# Altium schematic sheet Controller.SchDoc
size 420 x 297 mm; SheetNumber: 4; SheetTotal: 4
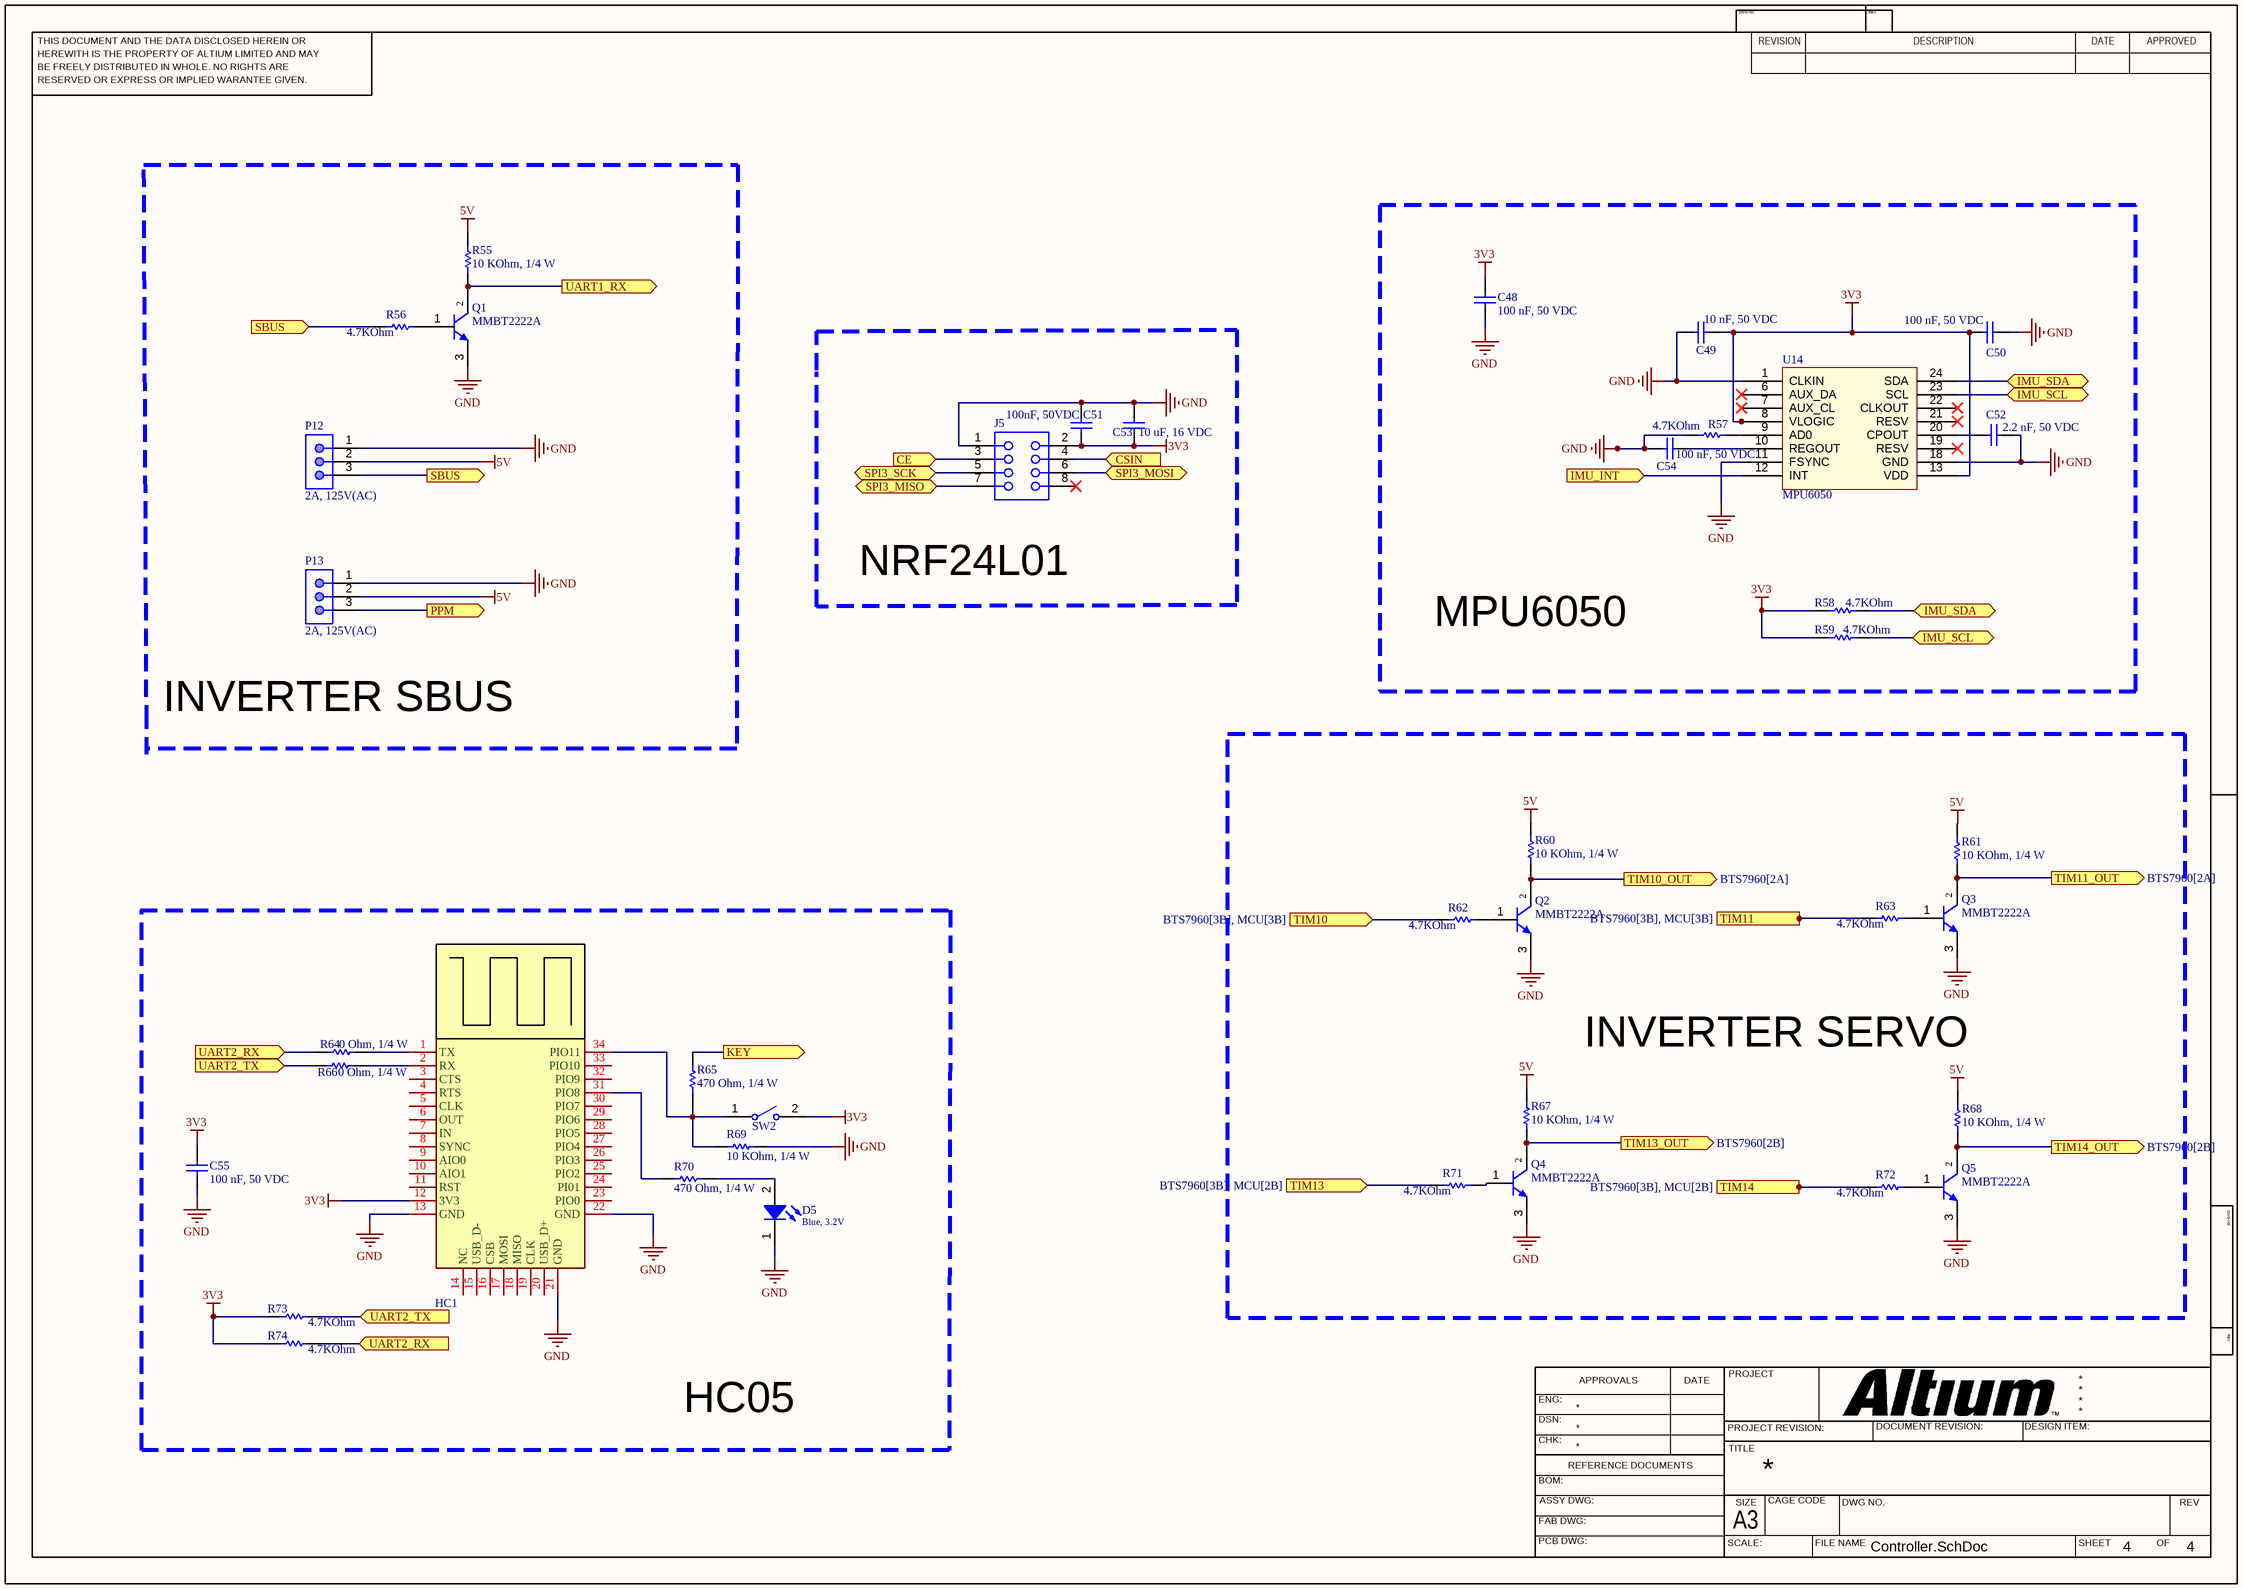
[diagram p0: Controller.SchDoc]

## Parts
C48  100 nF, 50 VDC  [CAP_0603]
C49  10 nF, 50 VDC  [CAP_0603]
C50  100 nF, 50 VDC  [CAP_0603]
C51  100nF, 50VDC  [CAP_0805]
C52  2.2 nF, 50 VDC  [CAP_0603]
C53  10 uF, 16 VDC  [CAP_0805]
C54  100 nF, 50 VDC  [CAP_0603]
C55  100 nF, 50 VDC  [CAP_0603]
D5  Blue, 3.2V  [WL-SMCW_0603_H=0.7mm]
HC1  HC05  [PCBComponent_1]  (value not drawn)
J5  61300821821  [61300821821]  (value not drawn)
P12  2A, 125V(AC)  [62000311622]
P13  2A, 125V(AC)  [62000311622]
Q1  MMBT2222A  [MMBT-SOT23]
Q2  MMBT2222A  [MMBT-SOT23]
Q3  MMBT2222A  [MMBT-SOT23]
Q4  MMBT2222A  [MMBT-SOT23]
Q5  MMBT2222A  [MMBT-SOT23]
R55  10 KOhm, 1/4 W  [resistor_0603]
R56  4.7KOhm  [resistor_0603]
R57  4.7KOhm  [resistor_0603]
R58  4.7KOhm  [resistor_0603]
R59  4.7KOhm  [resistor_0603]
R60  10 KOhm, 1/4 W  [resistor_0603]
R61  10 KOhm, 1/4 W  [resistor_0603]
R62  4.7KOhm  [resistor_0603]
R63  4.7KOhm  [resistor_0603]
R64  0 Ohm, 1/4 W  [resistor_0603]
R65  470 Ohm, 1/4 W  [resistor_0603]
R66  0 Ohm, 1/4 W  [resistor_0603]
R67  10 KOhm, 1/4 W  [resistor_0603]
R68  10 KOhm, 1/4 W  [resistor_0603]
R69  10 KOhm, 1/4 W  [resistor_0603]
R70  470 Ohm, 1/4 W  [resistor_0603]
R71  4.7KOhm  [resistor_0603]
R72  4.7KOhm  [resistor_0603]
R73  4.7KOhm  [resistor_0603]
R74  4.7KOhm  [resistor_0603]
SW2  TS-1101-C-W  [TS-1101-C-W]  (value not drawn)
U14  MPU6050  [IS-QFN-24_V]

## Blocks framed on the sheet
MPU6050: C48-C50 C52 C54 R57-R59 U14
NRF24L01: C51 C53 J5
INVERTER SERVO: Q2-Q5 R60-R63 R67 R68 R71 R72
HC05: C55 D5 HC1 R64-R66 R69 R70 R73 R74 SW2

## Ports
CE (in, see MCU[3B]), CSIN (in, see MCU[3B]), IMU_INT (in, see MCU[2B]), IMU_SCL (bidir, see Controller[6A], MCU[3B]), IMU_SCL (bidir, see Controller[6B], MCU[3B]), IMU_SDA (bidir, see Controller[6A], MCU[3B]), IMU_SDA (bidir, see Controller[6B], MCU[3B]), KEY (out), PPM (out, see MCU[2B]), SBUS (in, see Controller[2B]), SBUS (out, see Controller[1A]), SPI3_MISO (bidir, see MCU[2B]), SPI3_MOSI (bidir, see MCU[2B]), SPI3_SCK (bidir, see MCU[2B]), TIM10 (in, see BTS7960[3B], MCU[3B]), TIM10_OUT (out, see BTS7960[2A]), TIM11 (in, see BTS7960[3B], MCU[3B]), TIM11_OUT (out, see BTS7960[2A]), TIM13 (in, see BTS7960[3B], MCU[2B]), TIM13_OUT (out, see BTS7960[2B]), TIM14 (in, see BTS7960[3B], MCU[2B]), TIM14_OUT (out, see BTS7960[2B]), UART1_RX (out, see MCU[2B]), UART2_RX (in, see Controller[1C], MCU[2A]), UART2_RX (in, see Controller[1D], MCU[2A]), UART2_TX (in, see Controller[1C], MCU[2A]), UART2_TX (in, see Controller[1D], MCU[2A])

## Nets
3V3: C48.1 C49.2 C50.1 C51.1 C53.1 C55.1 HC1.12(3V3) J5.2 R58.2 R59.1 R73.2 R74.1 SW2.2 U14.8(VLOGIC) U14.13(VDD)
5V: P12.2 P13.2 R55.2 R60.2 R61.2 R67.2 R68.2
GND: C48.2 C49.1 C50.2 C51.2 C52.1 C53.2 C54.1 C55.2 D5.1(K) HC1.13(GND) HC1.21(GND) HC1.22(GND) J5.1 P12.1 P13.1 Q1.3(E) Q2.3(E) Q3.3(E) Q4.3(E) Q5.3(E) R57.2 R69.2 U14.1(CLKIN) U14.11(FSYNC) U14.18(GND)
CE: J5.3 ; port CE
CSIN: J5.4 ; port CSIN
IMU_INT: U14.12(INT) ; port IMU_INT
IMU_SCL: R59.2 U14.23(SCL) ; port IMU_SCL
IMU_SDA: R58.1 U14.24(SDA) ; port IMU_SDA
KEY: R65.2 ; port KEY
PPM: P13.3 ; port PPM
SBUS: P12.3 R56.1 ; port SBUS
SPI3_MISO: J5.7 ; port SPI3_MISO
SPI3_MOSI: J5.6 ; port SPI3_MOSI
SPI3_SCK: J5.5 ; port SPI3_SCK
TIM10: R62.1 ; port TIM10
TIM10_OUT: Q2.2(C) R60.1 ; port TIM10_OUT
TIM11: R63.1 ; port TIM11
TIM11_OUT: Q3.2(C) R61.1 ; port TIM11_OUT
TIM13: R71.1 ; port TIM13
TIM13_OUT: Q4.2(C) R67.1 ; port TIM13_OUT
TIM14: R72.1 ; port TIM14
TIM14_OUT: Q5.2(C) R68.1 ; port TIM14_OUT
UART1_RX: Q1.2(C) R55.1 ; port UART1_RX
UART2_RX: R64.1 R74.2 ; port UART2_RX
UART2_TX: R66.1 R73.1 ; port UART2_TX
NetC52_2: C52.2 U14.20(CPOUT)
NetC54_2: C54.2 U14.10(REGOUT)
NetD5_2: D5.2(A) R70.2
NetHC1_1: HC1.1(TX) R64.2
NetHC1_2: HC1.2(RX) R66.2
NetHC1_31: HC1.31(PIO8) R70.1
NetHC1_34: HC1.34(PIO11) R65.1 R69.1 SW2.1
NetQ1_1: Q1.1(B) R56.2
NetQ2_1: Q2.1(B) R62.2
NetQ3_1: Q3.1(B) R63.2
NetQ4_1: Q4.1(B) R71.2
NetQ5_1: Q5.1(B) R72.2
NetR57_1: R57.1 U14.9(AD0)

Not connected (* = marked no-connect by the designer): HC1 3(CTS) 4(RTS) 5(CLK) 6(OUT) 7(IN) 8(SYNC) 9(AIO0) 10(AIO1) 11(RST) 14(NC) 15(USB_D-) 16(CSB) 17(MOSI) 18(MISO) 19(CLK) 20(USB_D+) 23(PIO0) 24(PI01) 25(PIO2) 26(PIO3) 27(PIO4) 28(PIO5) 29(PIO6) 30(PIO7) 32(PIO9) 33(PIO10); J5 8*; U14 6(AUX_DA)* 7(AUX_CL)* 19(RESV)* 21(RESV)* 22(CLKOUT)*

## Notes on the sheet
- INVERTER SBUS
- THIS DOCUMENT AND THE DATA DISCLOSED HEREIN OR
- HEREWITH IS THE PROPERTY OF ALTIUM LIMITED AND MAY
- DWG NO:
- REVISION
- REV:
- DESCRIPTION
- DATE
- APPROVED
- BE FREELY DISTRIBUTED IN WHOLE. NO RIGHTS ARE
- RESERVED OR EXPRESS OR IMPLIED WARANTEE GIVEN.
- ENG:
- APPROVALS
- PROJECT
- DSN:
- CHK:
- REFERENCE DOCUMENTS
- PROJECT REVISION:
- TITLE
- DOCUMENT REVISION:
- DESIGN ITEM:
- BOM:
- FAB DWG:
- PCB DWG:
- ASSY DWG:
- SCALE:
- A3
- SIZE
- CAGE CODE
- FILE NAME
- DWG NO.
- SHEET
- OF
- REV

## Library data of the parts
C48 C50 C54 C55 = 0106031041050: CAP, size 0603, 100 nF, 50 VDC; Manufacture Name: TDK; Manufacture SN: CGA3E3X8R1H104K080AE; Capacitance: 100 nF; Tolerance: +/-10%; Voltage Rating DC: 50 VDC; ComponentLink2Description: Datasheet; ComponentLink2URL: https://product.tdk.com/system/files/dam/doc/product/capacitor/ceramic/mlcc/catalog/mlcc_automotive_soft_en.pdf?ref_disty=mouser; Operating Temperature: -55 to +125degC; Packaging: Tape and Reel; Mounting Technology: SMT; Size: 0603; Supplier 1 Name: Mouser; Supplier 1 SN: 810-CGA3E3X8R1H104KA; Supplier 1 URL: https://www.mouser.com/ProductDetail/TDK/CGA3E3X8R1H104K080AE?qs=nQSIdc08i%252Bd8g3IRRgU2bw%3D%3D&utm_source=mouser-refine-download&utm_medium=file&utm_campaign=CGA3E3X8R1H104K080AE&utm_content=TDK; Supplier 2 Name: Digi-Key; Supplier 2 SN: 445-173697-2-ND; Supplier 2 URL: https://www.digikey.com/en/products/detail/tdk-corporation/cga3e3x8r1h104k080ae/5809262; Supplier 3 Name: thegioiic; Supplier 3 SN: N/A; Supplier 3 URL: N/A; Value: 100 nF, 50 VDC
C49 = 0106031030550: CAP, size 0603, 10 nF, 50 VDC; Manufacture Name: TDK; Manufacture SN: CGA3E2C0G1H103J080AE; Capacitance: 10 nF; Tolerance: +/-5%; Voltage Rating DC: 50 VDC; ComponentLink2Description: Datasheet; ComponentLink2URL: https://product.tdk.com/system/files/dam/doc/product/capacitor/ceramic/mlcc/catalog/mlcc_automotive_soft_en.pdf?ref_disty=mouser; Operating Temperature: -55 to +125degC; Packaging: Tape and Reel; Mounting Technology: SMT; Size: 0603; Supplier 1 Name: Mouser; Supplier 1 SN: 810-CGA3E2C0G1H103J8; Supplier 1 URL: https://www.mouser.com/ProductDetail/TDK/CGA3E2C0G1H103J080AE?qs=P1JMDcb91o6ZkMITrWTUZQ%3D%3D&utm_source=mouser-refine-download&utm_medium=file&utm_campaign=CGA3E2C0G1H103J080AE&utm_content=TDK; Supplier 2 Name: Digi-Key; Supplier 2 SN: 445-CGA3E2C0G1H103J080AETR-ND; Supplier 2 URL: https://www.digikey.com/en/products/detail/tdk-corporation/cga3e2c0g1h103j080ae/11697946; Supplier 3 Name: thegioiic; Supplier 3 SN: N/A; Supplier 3 URL: N/A; Value: 10 nF, 50 VDC
C51 = 0108051541050: CAP, size 0805, 150 nF, 50 VDC; Manufacture Name: TDK; Manufacture SN: CGA4J2X7R1H154K125AD; Capacitance: 150 nF; Tolerance: +/-10%; ComponentLink2Description: Datasheet; ComponentLink2URL: https://product.tdk.com/system/files/dam/doc/product/capacitor/ceramic/mlcc/catalog/mlcc_automotive_epoxy_en.pdf?ref_disty=mouser; Operating Temperature: -55 to +125degC; Packaging: Tape and Reel; Mounting Technology: SMT; Size: 0805; Supplier 1 Name: Mouser; Supplier 1 SN: 810-CGA4J2X7R1H154KD; Supplier 1 URL: https://www.mouser.vn/ProductDetail/TDK/CGA4J2X7R1H154K125AD?qs=xLDY6iXSiQYlxmVq9lRXDA%3D%3D&utm_source=mouser-refine-download&utm_medium=file&utm_campaign=CGA4J2X7R1H154K125AD&utm_content=TDK; Supplier 2 Name: Digi-Key; Supplier 2 SN: 445-9929-2-ND; Supplier 2 URL: https://www.digikey.com/en/products/detail/tdk-corporation/cga4j2x7r1h154k125ad/3933662; Supplier 3 Name: thegioiic; Supplier 3 SN: OEM; Supplier 3 URL: N/A; Voltage Rating DC: 50 VDC; Value: 150 nF, 50 VDC
C52 = 0106032220550: CAP, size 0603, 2.2 nF, 50 VDC; Manufacture Name: TDK; Manufacture SN: CGA3E2C0G1H222J080AE; Capacitance: 2.2 nF; Tolerance: +/-5%; Voltage Rating DC: 50 VDC; ComponentLink2Description: Datasheet; ComponentLink2URL: https://product.tdk.com/system/files/dam/doc/product/capacitor/ceramic/mlcc/catalog/mlcc_automotive_soft_en.pdf?ref_disty=mouser; Operating Temperature: -55 to +125degC; Packaging: Tape and Reel; Mounting Technology: SMT; Size: 0603; Supplier 1 Name: Mouser; Supplier 1 SN: 810-CGA3E2C0G1H222J8; Supplier 1 URL: https://www.mouser.com/ProductDetail/TDK/CGA3E2C0G1H222J080AE?qs=P1JMDcb91o5KNu2GzASXrQ%3D%3D&utm_source=mouser-refine-download&utm_medium=file&utm_campaign=CGA3E2C0G1H222J080AE&utm_content=TDK; Supplier 2 Name: Digi-Key; Supplier 2 SN: 445-CGA3E2C0G1H222J080AETR-ND; Supplier 2 URL: https://www.digikey.com/en/products/detail/tdk-corporation/cga3e2c0g1h222j080ae/11697925; Supplier 3 Name: thegioiic; Supplier 3 SN: N/A; Supplier 3 URL: N/A; Value: 2.2 nF, 50 VDC
C53 = 0108051061016: CAP, size 0805, 10 uF, 16 VDC; Manufacture Name: TDK; Manufacture SN: CGA4J1X7S1C106K125AE; Capacitance: 10 uF; Tolerance: +/-10%; Voltage Rating DC: 16 VDC; ComponentLink2Description: Datasheet; ComponentLink2URL: https://product.tdk.com/system/files/dam/doc/product/capacitor/ceramic/mlcc/catalog/mlcc_automotive_soft_en.pdf?ref_disty=mouser; Operating Temperature: -55 to +125degC; Packaging: Tape and Reel; Mounting Technology: SMT; Size: 0805; Supplier 1 Name: Mouser; Supplier 1 SN: 810-CGA4J1X7S1C106KA; Supplier 1 URL: https://www.mouser.vn/ProductDetail/TDK/CGA4J1X7S1C106K125AE?qs=nQSIdc08i%252Bda5YDbrVYncg%3D%3D&utm_source=mouser-refine-download&utm_medium=file&utm_campaign=CGA4J1X7S1C106K125AE&utm_content=TDK; Supplier 2 Name: Digi-Key; Supplier 2 SN: 445-173674-2-ND; Supplier 2 URL: https://www.digikey.com/en/products/detail/tdk-corporation/cga4j1x7s1c106k125ae/5809239; Supplier 3 Name: thegioiic; Supplier 3 SN: OEM; Supplier 3 URL: N/A; Value: 10 uF, 16 VDC
D5 = 160603BlueBlur: WL-SMCW SMT Mono-color Chip LED Blur, size 0603, Blue, 3.2V, 140deg; Color: Blue; Size: 0603; Type: Blur; ComponentLink1Description: Datasheet link; ComponentLink1URL: N/A; ComponentLink2Description: Supplier 1 URL; ComponentLink2URL: https://www.mouser.vn/ProductDetail/ams-OSRAM/LB-Q39E-L2OO-35-1?qs=74fRo9GAWsz%2FeNvglIOl1w%3D%3D; ComponentLink3Description: Supplier 2 URL; ComponentLink3URL: https://www.digikey.com/en/products/detail/ams-osram-usa-inc/LB-Q39E-N1OO-35-1/2176321; ComponentLink4Description: Supplier 3 URL; ComponentLink4URL: N/A; Supplier 1 Name: Mouser; Supplier 1 SN: 720-LBQ39EL2N2351; Supplier 1 URL: https://www.mouser.vn/ProductDetail/ams-OSRAM/LB-Q39E-L2OO-35-1?qs=74fRo9GAWsz%2FeNvglIOl1w%3D%3D; Supplier 2 Name: Digi-Key; Supplier 2 SN: 475-LBQ39E-N1OO-35-1TR-ND; Supplier 2 URL: https://www.digikey.com/en/products/detail/ams-osram-usa-inc/LB-Q39E-N1OO-35-1/2176321; Supplier 3 Name: ICDayRoi; Supplier 3 SN: N/A; Supplier 3 URL: N/A; Value: Blue, 3.2V
J5 = 61300821821: WR-PHD Socket Header, THT, pitch 2.54mm, Dual Row, Vertical, 8p; Manufacturer: Wurth Elektronik; Pin Number: 8; Rated Current: 3A; Working Voltage: 250VAC; Withstanding Voltage: 500VAC; Contact Resistance: 20mOhm; ComponentLink1Description: Manufacturer; ComponentLink1URL: http://www.we-online.de; ComponentLink2Description: Datasheet; ComponentLink2URL: https://www.we-online.com/catalog/datasheet/61300821821.pdf; Manufacturer Part Number: 61300821821; Published Date: May 2020; Pitch: 2.54mm; Operating Temperature: -40 to +125degC; Mounting Technology: THT; Packaging: Tray; Gender: Socket Header; Row Number: Dual; Orientation: Vertical; ComponentLink3Description: Global Supply; ComponentLink3URL: https://www.we-online.com/en/components/products/PHD_2_54_DUAL_SOCKET_HEADER_6130XX21821?sq=61300821821#61300821821; ComponentLink4Description: Global Supply; ComponentLink4URL: https://www.mouser.vn/ProductDetail/Wurth-Elektronik/61300821821?qs=iLbezkQI%252BshycHY3p31Znw%3D%3D; ComponentLink5Description: Local Supply; ComponentLink5URL: https://www.thegioiic.com/hang-rao-cai-doi-2-54mm-8-chan-2-hang-cao-11-8mm-xuyen-lo; Supplier 1 Name: Mouser; Supplier 1 SN: 710-61300821821; Supplier 1 URL: https://www.mouser.vn/ProductDetail/Wurth-Elektronik/61300821821?qs=iLbezkQI%252BshycHY3p31Znw%3D%3D; Supplier 2 Name: Digi-Key; Supplier 2 SN: N/A; Supplier 2 URL: N/A; Supplier 3 Name: thegioiic; Supplier 3 SN: N/A; Supplier 3 URL: https://www.thegioiic.com/hang-rao-cai-doi-2-54mm-8-chan-2-hang-cao-11-8mm-xuyen-lo
P12 P13 = 62000311622: WR-WTB Male Vertical Shrouded Header, pitch 2mm, 3p; Pin Number: 3; Contact Resistance: 20mOhm; Withstanding Voltage: 800VAC; Working Voltage: 125VAC; ComponentLink1Description: Manufacturer; ComponentLink1URL: http://www.we-online.de; ComponentLink2Description: Datasheet; ComponentLink2URL: https://www.we-online.com/catalog/datasheet/62000311622.pdf; Pitch: 2mm; Published Date: January 2020; Publisher: Wurth Elektronik; Mounting Technology: THT; Packaging: Bag; Operating Temperature: -25 to +85degC; Part Number: 62000311622; Gender: Male; Type: Vertical; Rated Current: 2A; ComponentLink3Description: Global Supply; ComponentLink3URL: https://www.we-online.com/en/components/products/WTB_2_00_MALE_VERTICAL_SHROUDED_HEADER_6200XX11622?sq=62000311622#62000311622; Supplier 1 Name: Mouser; Supplier 1 SN: N/A; Supplier 1 URL: N/A; Supplier 2 Name: Digi-Key; Supplier 2 SN: N/A; Supplier 2 URL: N/A; Supplier 3 Name: thegioiic; Supplier 3 SN: N/A; Supplier 3 URL: N/A; Value: 2A, 125V(AC)
Q1-Q5 = MMBT2222A: TRANS NPN, 40V, 600MA, SOT23-3; DC Current Gain: 35-300; Gain Bandwidth Product fT: 250MHz; Power Dissipation: 250mW; Current - Collector: 600mA; Package: SOT-23; Supplier 1 Name: Mouser; Supplier 1 SN: 637-MMBT2222A; Supplier 1 URL: https://www.mouser.vn/ProductDetail/Diotec-Semiconductor/MMBT2222A?qs=OlC7AqGiEDl9N1c3%252BL%2F%252Brw%3D%3D; Supplier 2 Name: Digi-Key; Supplier 2 SN: 2796-MMBT2222ATR-ND; Supplier 2 URL: https://www.digikey.com/en/products/detail/diotec-semiconductor/MMBT2222A/13163394; Supplier 3 Name: thegioiic; Supplier 3 URL: https://www.thegioiic.com/mmbt2222a-transistor-npn-40v-0-6a-3-chan-sot-23; Transistor Type: NPN; Voltage - Collector Emitter Breakdown: 40V; Supplier 3 SN: N/A; Value: MMBT2222A
R55 R60 R61 R67-R69 = 0006031031: RES, size 0603, 10 KOhm, 1/4 W; Manufacture  Name: OEM; Resistance: 10 KOhm; Rated Power: 1/4 W; Resistance Tolerance: +/-1%; Size: 0603; Mounting Technology: SMT; Supplier 1 Name: Mouser; Supplier 1 SN: 755-ESR03EZPF1002; Supplier 2 Name: Digi-Key; Supplier 2 SN: RHM10KADTR-ND RHM10KADCT-ND RHM10KADDKR-ND; Supplier 1 URL: https://www.mouser.vn/ProductDetail/ROHM-Semiconductor/ESR03EZPF1002?qs=sGAEpiMZZMvdGkrng054t67Efho1F8r6CDeAsqwFse8%3D; Supplier 3 Name: thegioiic; Supplier 3 SN: N/A; Supplier 3 URL: N/A; Manufacture  SN: OEM; Value: 10 KOhm, 1/4 W; ComponentLink1Description: Datasheet link; ComponentLink1URL: https://fscdn.rohm.com/en/products/databook/datasheet/passive/resistor/chip_resistor/esr-e.pdf; ComponentLink2Description: Supplier 1 URL; ComponentLink2URL: N/A; ComponentLink3Description: Supplier 2 URL; ComponentLink3URL: https://www.digikey.com/en/products/detail/rohm-semiconductor/ESR03EZPF1002/1983429; ComponentLink4Description: Supplier 3 URL; ComponentLink4URL: N/A; Supplier 2 URL: https://www.digikey.com/en/products/detail/rohm-semiconductor/ESR03EZPF1002/1983429
R56 R62 R63 R71 R72 = 0006034755: RES, size 0603, 4.7 MOhm, 1/4 W; Manufacture  Name: ROHM Semiconductor; Manufacture  SN: ESR03EZPJ475; Rated Power: 1/4 W; Resistance Tolerance: +/-5%; Size: 0603; Mounting Technology: SMT; Resistance: 4.7 MOhm; Supplier 1 Name: Mouser; Supplier 1 SN: 755-ESR03EZPJ475; Supplier 1 URL: https://www.mouser.vn/ProductDetail/ROHM-Semiconductor/ESR03EZPJ475?qs=493kPxzlxfJ6jBG7c1mIWA%3D%3D; Supplier 2 Name: Digi-Key; Supplier 2 SN: https://www.digikey.com/en/products/detail/rohm-semiconductor/ESR03EZPJ475/4051264?s=N4IgTCBcDaIOwFYEFoCiBlASgBgMyoC0AFAKQBZEQBdAXyA; Supplier 3 Name: thegioiic; Supplier 3 SN: N/A; Supplier 3 URL: N/A; Value: 4.7 MOhm, 1/4 W; ComponentLink1Description: Datasheet link; ComponentLink1URL: https://www.mouser.vn/datasheet/2/348/ROHM_S_A0011075102_1-2563252.pdf; ComponentLink2Description: Supplier 1 URL; ComponentLink2URL: N/A; ComponentLink3Description: Supplier 2 URL; ComponentLink3URL: https://www.digikey.com/en/products/detail/rohm-semiconductor/ESR03EZPJ475/4051264?s=N4IgTCBcDaIOwFYEFoCiBlASgBgMyoC0AFAKQBZEQBdAXyA; ComponentLink4Description: Supplier 3 URL; ComponentLink4URL: N/A; Supplier 2 URL: https://www.digikey.com/en/products/detail/rohm-semiconductor/ESR03EZPJ475/4051264?s=N4IgTCBcDaIOwFYEFoCiBlASgBgMyoC0AFAKQBZEQBdAXyA
R57-R59 R73 R74 = 0006034425: RES, size 0603, 4.4 KOhm, 1/4 W; Manufacture  Name: OEM; Rated Power: 1/4 W; Resistance Tolerance: +/-5%; Size: 0603; Mounting Technology: SMT; Resistance: 4.4 KOhm; Supplier 1 Name: Mouser; Supplier 1 SN: N/A; Supplier 1 URL: N/A; Supplier 2 Name: Digi-Key; Supplier 2 SN: N/A; Supplier 3 Name: thegioiic; Supplier 3 SN: N/A; Supplier 3 URL: N/A; Manufacture  SN: OEM; Value: 4.4 KOhm, 1/4 W; ComponentLink1Description: Datasheet link; ComponentLink1URL: N/A; ComponentLink2Description: Supplier 1 URL; ComponentLink2URL: N/A; ComponentLink3Description: Supplier 2 URL; ComponentLink3URL: N/A; ComponentLink4Description: Supplier 3 URL; ComponentLink4URL: N/A; Supplier 2 URL: N/A
R64 = 0006030001: RES, size 0603, 0 Ohm, 1/4 W; Manufacture  Name: YAGEO; Manufacture  SN: AC0603FR-070RL; Resistance: 0 Ohm; Rated Power: 1/4 W; Resistance Tolerance: +/-1%; Size: 0603; Mounting Technology: SMT; Supplier 1 Name: Mouser; Supplier 1 SN: 603-AC0603FR-070RL; Supplier 2 Name: Digi-Key; Supplier 2 SN: 311-0.0LDTR-ND; Supplier 1 URL: https://www.mouser.com/ProductDetail/YAGEO/AC0603FR-070RL?qs=sGAEpiMZZMtlubZbdhIBIOG3KwTtqrl%2FD2D%252BGuMCfoY%3D; Supplier 3 Name: thegioiic; Supplier 3 SN: N/A; Supplier 3 URL: https://www.thegioiic.com/dien-tro-0-ohm-0603-1-; Value: 0 Ohm, 1/4 W; ComponentLink1Description: Datasheet link; ComponentLink1URL: https://www.mouser.com/datasheet/2/447/Yageo_06282023_ACseries-3224032.pdf; ComponentLink2Description: Supplier 1 URL; ComponentLink2URL: N/A; ComponentLink3Description: Supplier 2 URL; ComponentLink3URL: https://www.digikey.com/en/products/detail/yageo/ac0603fr-070rl/2827812; ComponentLink4Description: Supplier 3 URL; ComponentLink4URL: N/A; Supplier 2 URL: https://www.digikey.com/en/products/detail/yageo/ac0603fr-070rl/2827812
R65 R70 = 0006034711: RES, size 0603, 470 Ohm, 1/4 W; Manufacture  Name: OEM; Resistance: 470 Ohm; Rated Power: 1/4 W; Resistance Tolerance: +/-1%; Size: 0603; Mounting Technology: SMT; Supplier 1 Name: Mouser; Supplier 1 SN: 667-ERJ-UP3F4700V; Supplier 2 Name: Digi-Key; Supplier 2 SN: 10-ERJ-UP3F4700VTR-ND 10-ERJ-UP3F4700VCT-ND 10-ERJ-UP3F4700VDKR-ND; Supplier 1 URL: https://www.mouser.vn/ProductDetail/Panasonic/ERJ-UP3F4700V?qs=sGAEpiMZZMvdGkrng054twq3eZrCFN89YP9%2F6do01QmKc1dooCCEdg%3D%3D; Supplier 3 Name: thegioiic; Supplier 3 SN: N/A; Supplier 3 URL: N/A; Manufacture  SN: OEM; Value: 470 Ohm, 1/4 W; ComponentLink1Description: Datasheet link; ComponentLink1URL: https://api.pim.na.industrial.panasonic.com/file_stream/main/fileversion/4484; ComponentLink2Description: Supplier 1 URL; ComponentLink2URL: N/A; ComponentLink3Description: Supplier 2 URL; ComponentLink3URL: https://www.digikey.com/en/products/detail/panasonic-electronic-components/ERJ-UP3F4700V/12139344; ComponentLink4Description: Supplier 3 URL; ComponentLink4URL: N/A; Supplier 2 URL: https://www.digikey.com/en/products/detail/panasonic-electronic-components/ERJ-UP3F4700V/12139344
R66 = 0006030005: RES, size 0603, 0 Ohm, 1/4 W; Manufacture  Name: YAGEO; Manufacture  SN: RC0603JR-070RL; Resistance: 0 Ohm; Rated Power: 1/4 W; Resistance Tolerance: +/-1%; Size: 0603; Mounting Technology: SMT; Supplier 1 Name: Mouser; Supplier 1 SN: 603-RC0603JR-070RL; Supplier 2 Name: Digi-Key; Supplier 2 SN: 311-0.0GRTR-ND; Supplier 1 URL: https://www.mouser.com/ProductDetail/YAGEO/RC0603JR-070RL?qs=2cAdsCoAWRGWyPcuXgGiXQ%3D%3D; Supplier 3 Name: thegioiic; Supplier 3 SN: N/A; Supplier 3 URL: https://www.thegioiic.com/dien-tro-0-ohm-0603-5-; Value: 0 Ohm, 1/4 W; ComponentLink1Description: Datasheet link; ComponentLink1URL: https://www.mouser.com/datasheet/2/447/YAGEO_PYu_RC_Group_51_RoHS_L_12-3313492.pdf; ComponentLink2Description: Supplier 1 URL; ComponentLink2URL: N/A; ComponentLink3Description: Supplier 2 URL; ComponentLink3URL: https://www.digikey.com/en/products/detail/yageo/rc0603jr-070rl/726675; ComponentLink4Description: Supplier 3 URL; ComponentLink4URL: N/A; Supplier 2 URL: https://www.digikey.com/en/products/detail/yageo/rc0603jr-070rl/726675
SW2 = TS-1101-C-W: Tact Switch, L6 x W3.8 x H2.5mm, 260g, SPST-NO, 12V, 50mA; Manufacturer: Wurth Elektronik; Match Code: WS-TASV; Washable: No; Rated Voltage: 12VDC; Manufacturer Part Number: TS-1101-C-W; Category: Tact Switches; Mount: Surface Mount; Operating Temperature Max: 85°C; Operating Temperature Min: -40°C; Packaging: Tape and Reel; Length: 6mm; Width: 3.6mm; Height: 2.5mm; Circuit: SPST-NO; Contact Material: Stainless Steel; Operation Force: 260g; Rated Current: 50mA; Terminal Material: Copper Alloy; Terminal Plating: Silver; Supplier 1 URL: N/A; Supplier 2 URL: N/A; Supplier 3 URL: https://www.thegioiic.com/nut-nhan-3-5x6mm-cao-2-5mm-2-chan-smd-dau-do; LCSC Part #: XKB Connectivity; ComponentLink1Description: Datasheet; ComponentLink1URL: https://www.we-online.com/redexpert/spec/434111025826?ad; Package / Case: 0805; Supplier 1: Mouser; Supplier 1 Part Number: N/A; Supplier 2: Digi-Key; Supplier 2 Part Number: N/A; Supplier 3: thegioiic; Supplier 3 Part Number: OEM; Value: TS-1101-C-W